# Altium schematic sheet Power.SchDoc
size A3; SheetNumber: 4; SheetTotal: 5
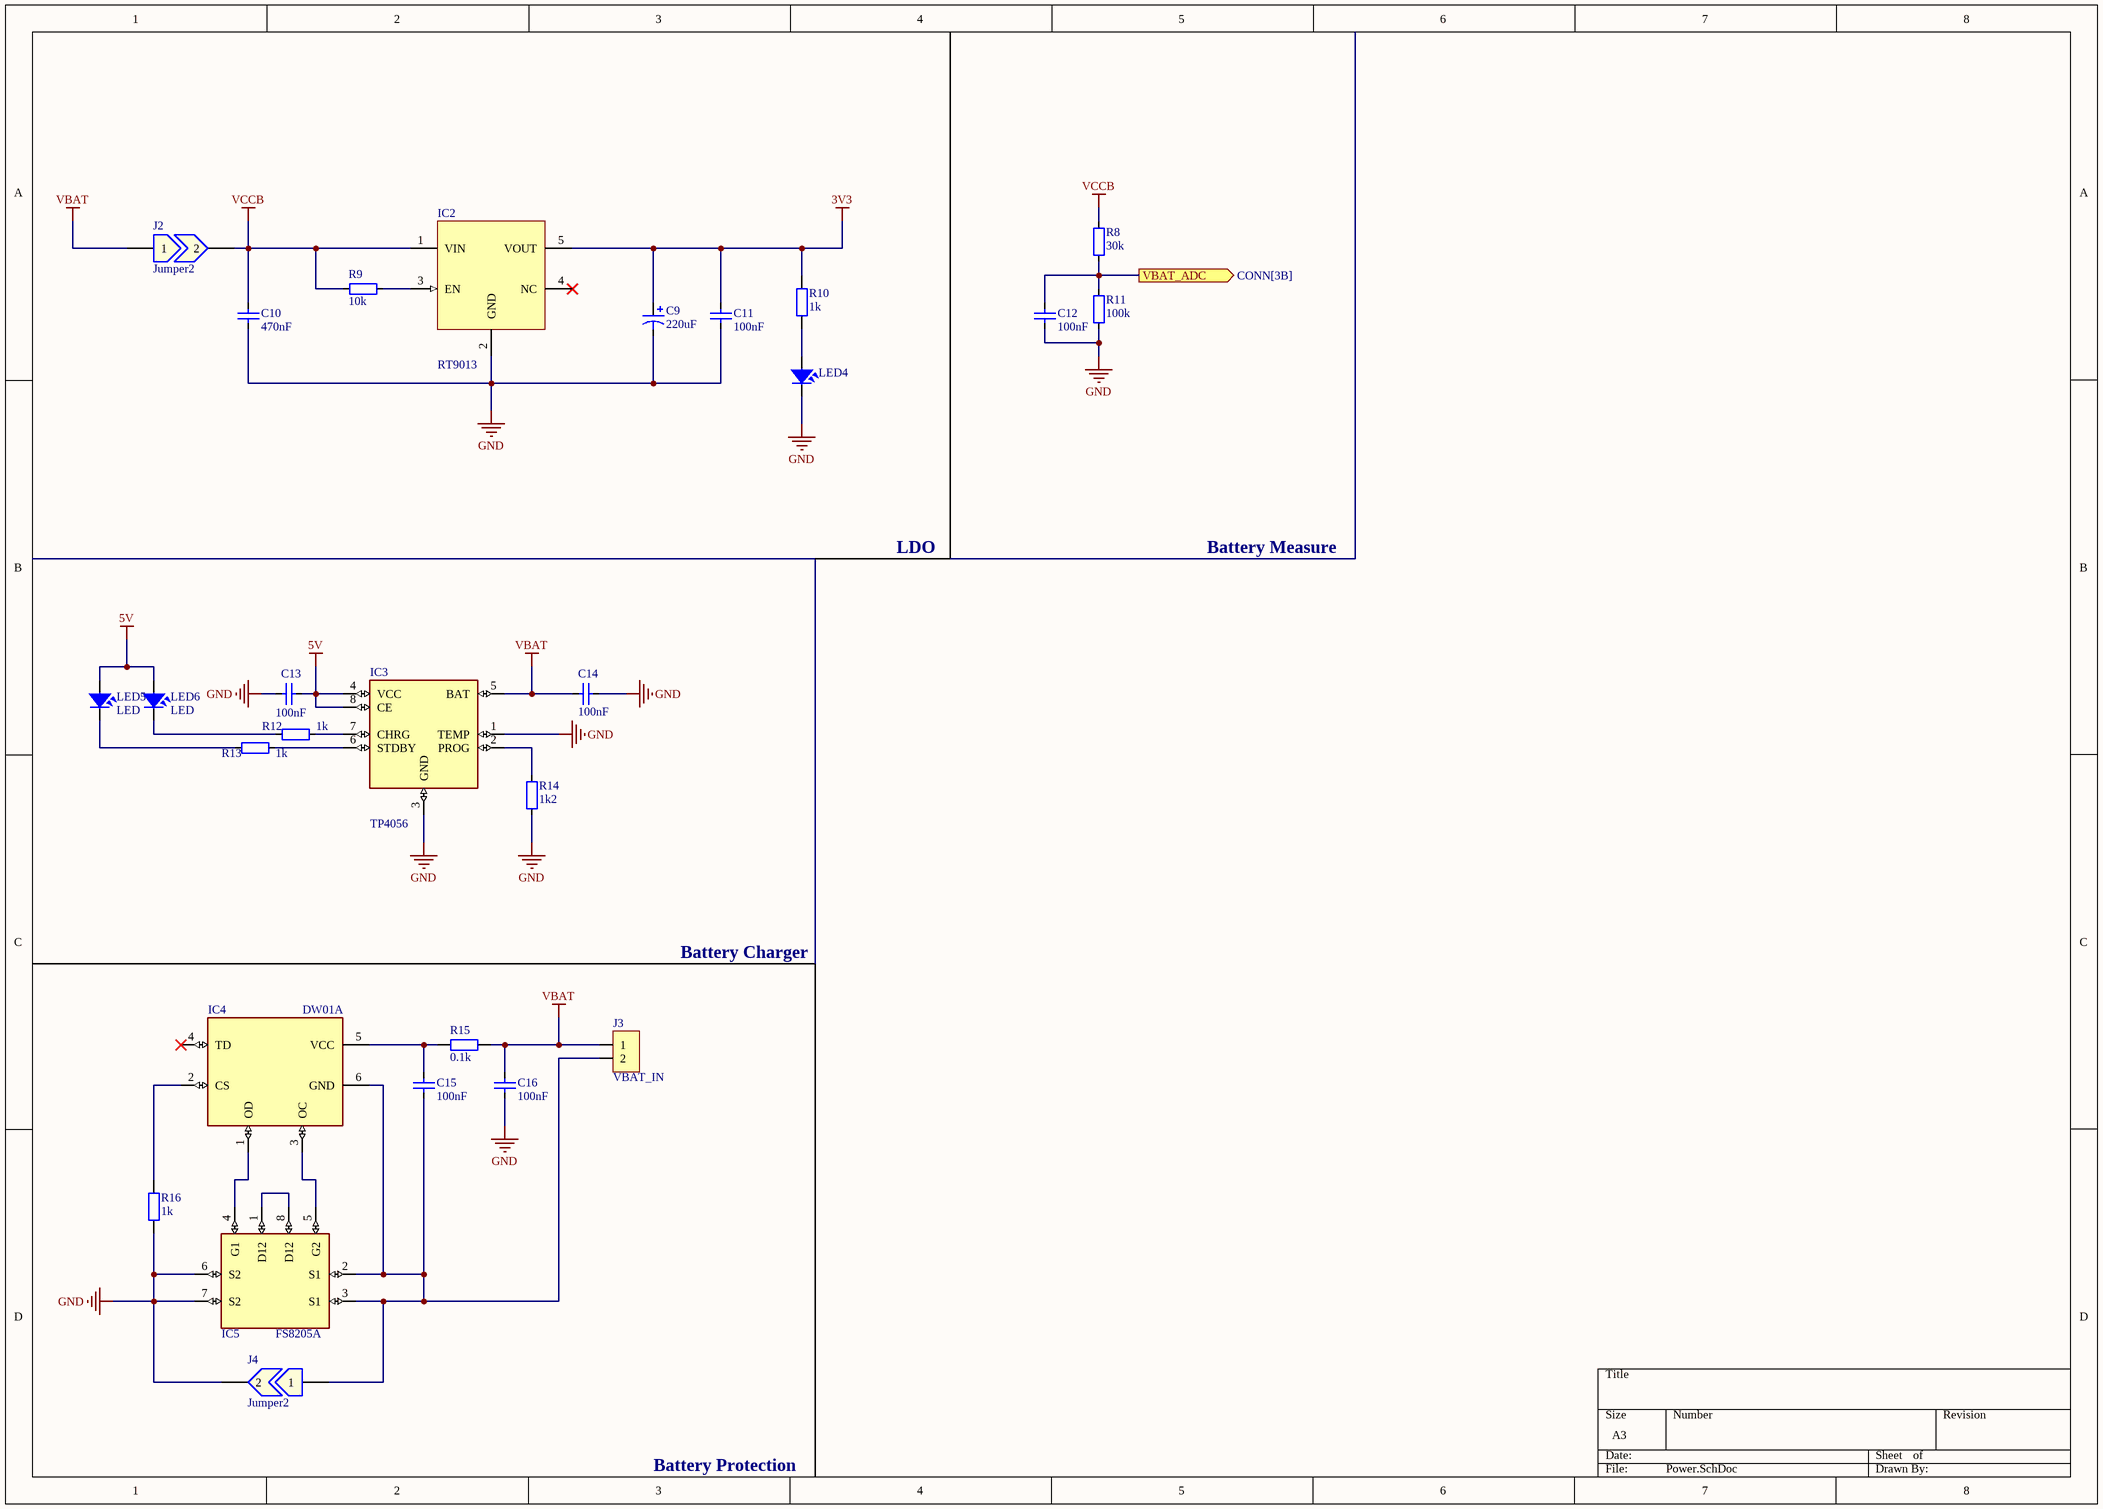
[diagram p0: Power.SchDoc]

## Parts
C9  220uF  [CAP_TANTALUM_3216]
C10  470nF  [CAP_0805]
C11  100nF  [CAP_0805]
C12  100nF  [CAP_0805]
C13  100nF  [CAP_0805]
C14  100nF  [CAP_0805]
C15  100nF  [CAP_0805]
C16  100nF  [CAP_0805]
IC2  RT9013  [SOT23-5]
IC3  TP4056  [TP4056]
IC4  DW01A  [SOT23-6]
IC5  FS8205A  [FS8205A]
J2  Jumper2  [JUMPER2]
J3  VBAT_IN  [JP2-D1T]
J4  Jumper2  [RES-SMD-0201]
LED4  (no value)  [LED-0805-Red]
LED5  LED  [LED-0805-Red]
LED6  LED  [LED-0805-Green]
R8  30k  [RES-SMD-0805]
R9  10k  [RES-SMD-0805]
R10  1k  [RES-SMD-0805]
R11  100k  [RES-SMD-0805]
R12  1k  [RES-SMD-0805]
R13  1k  [RES-SMD-0805]
R14  1k2  [RES-SMD-0805]
R15  0.1k  [RES-SMD-0805]
R16  1k  [RES-SMD-0805]

## Ports
VBAT_ADC (out, see CONN[3B])

## Nets
3V3: C9.1 C11.1 IC2.5(VOUT) R10.2
5V: C13.1 IC3.4(VCC) IC3.8(CE) LED5.1 LED6.1
GND: C9.2 C10.2 C11.2 C12.1 C13.2 C14.1 C16.1 IC2.2(GND) IC3.1(TEMP) IC3.3(GND) IC5.6(S2) IC5.7(S2) J4.2 LED4.2 R11.2 R14.1 R16.2
VBAT: C14.2 C16.2 IC3.5(BAT) J2.1 J3.1 R15.2
VCCB: C10.1 IC2.1(VIN) J2.2 R8.1 R9.2
VBAT_ADC: C12.2 R8.2 R11.1 ; port VBAT_ADC
NetC15_1: C15.1 IC4.6(GND) IC5.2(S1) IC5.3(S1) J3.2 J4.1
NetC15_2: C15.2 IC4.5(VCC) R15.1
NetIC2_3: IC2.3(EN) R9.1
NetIC3_2: IC3.2(PROG) R14.2
NetIC3_6: IC3.6(STDBY) R13.1
NetIC3_7: IC3.7(CHRG) R12.1
NetIC4_1: IC4.1(OD) IC5.4(G1)
NetIC4_2: IC4.2(CS) R16.1
NetIC4_3: IC4.3(OC) IC5.5(G2)
NetIC5_1: IC5.1(D12) IC5.8(D12)
NetLED4_1: LED4.1 R10.1
NetLED5_2: LED5.2 R13.2
NetLED6_2: LED6.2 R12.2

Not connected (* = marked no-connect by the designer): IC2 4(NC)*; IC4 4(TD)*

## Notes on the sheet
- LDO
- Battery Measure
- Battery Charger
- Battery Protection

## Library data of the parts
C9 = Cap Pol: Polarized Capacitor (Axial); Published: 8-Jun-2000; LatestRevisionDate: 17-Jul-2002; LatestRevisionNote: Re-released for DXP Platform.; PackageReference: POLAR0.8; Publisher: Altium Limited
C10-C16 = CapSMD: Capacitor; Value: 33p; Published: 8-Jun-2000; LatestRevisionDate: 17-Jul-2002; LatestRevisionNote: Re-released for DXP Platform.; PackageReference: RAD-0.3; Publisher: Altium Limited
IC2 = RT9013: https://linhkien.cxt.vn/5435-rt9013-33gb-ic-reg-linear-33v-500ma-sot23-5.html
IC3 = TP4056: Complete single cell Li-Ion battery with a constant current / constant voltage linear charger
IC4 = DW01A: One Cell Lithium-ion/Polymer Battery Protection IC
J2 J4 = Jumper2: Jumper, 2-Pin
J3 = JP2: WR-PHD 2.54 mm Angled Socket Header; Manufacturer: W¨¹rth Elektronik eiSos GmbH; partNo: 613002143121; ComponentLink1 Description: Manufacturer; ComponentLink2 Description: Datasheet; NoPins: 02; Created Date: 29 March 2013; ComponentLink1URL: http://www.we-online.com; ComponentLink2URL: http://katalog.we-online.de/em/datasheet/6130xx143121.pdf; Created by: Karrer Zheng
LED4-LED6 = LED: LED Single colour Green and Red; Value: LED 3 ly Single Colour
R8 R9 R11-R14 = Resistor - SMD: Resistor; Manufacturer: Generic Components; Class: Passive; Published: 08/06/2000; Publisher: Altium Hobart Technology Centre
R10 R15 R16 = Resistor - SMD: Resistor SMD; Manufacturer: Generic Components; Class: Passive; Published: 08/06/2000; Publisher: Altium Hobart Technology Centre